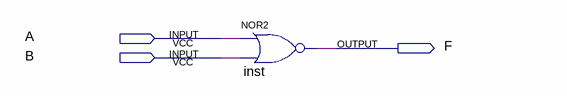
[diagram p0: schematic sheet]
// Quartus schematic or_not_Gate.bdf as structural Verilog: 1 symbols, 3 pins
module or_not_Gate (
  input  A,
  input  B,
  output F
);

  nor inst (F, A, B);
endmodule
